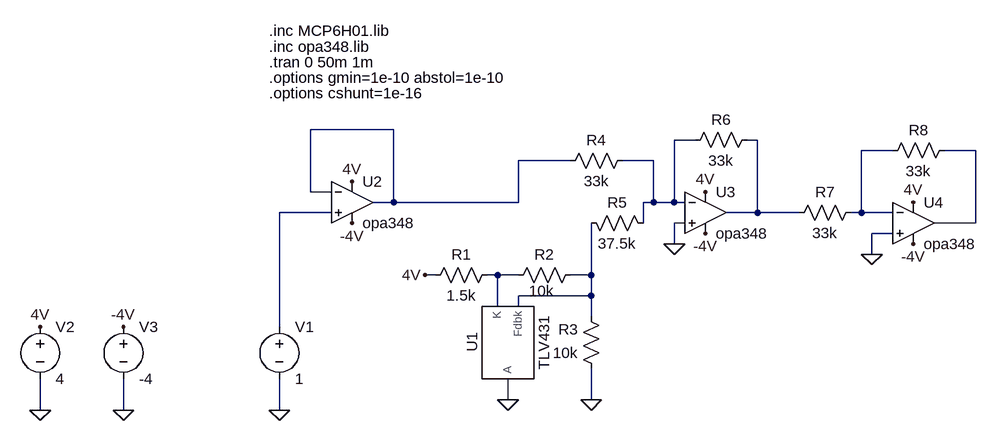
[diagram p0: schematic SUE_X.asc]
SUE_X.asc, the LTspice schematic file:
Version 4
SHEET 1 1056 680
WIRE 128 -160 0 -160
WIRE 592 -144 560 -144
WIRE 688 -144 672 -144
WIRE 896 -128 848 -128
WIRE 1024 -128 976 -128
WIRE 400 -112 320 -112
WIRE 528 -112 480 -112
WIRE 0 -64 0 -160
WIRE 32 -64 0 -64
WIRE 128 -48 128 -160
WIRE 128 -48 96 -48
WIRE 320 -48 320 -112
WIRE 320 -48 128 -48
WIRE 528 -48 528 -112
WIRE 528 -48 512 -48
WIRE 560 -48 560 -144
WIRE 560 -48 528 -48
WIRE 576 -48 560 -48
WIRE 32 -32 -48 -32
WIRE 688 -32 688 -144
WIRE 688 -32 640 -32
WIRE 752 -32 688 -32
WIRE 848 -32 848 -128
WIRE 848 -32 832 -32
WIRE 896 -32 848 -32
WIRE 512 -16 512 -48
WIRE 576 -16 560 -16
WIRE 1024 -16 1024 -128
WIRE 1024 -16 960 -16
WIRE 896 0 864 0
WIRE 560 16 560 -16
WIRE 864 32 864 0
WIRE 192 64 176 64
WIRE 288 64 272 64
WIRE 320 64 288 64
WIRE 432 64 432 -16
WIRE 432 64 400 64
WIRE 432 96 432 64
WIRE 432 96 320 96
WIRE 288 112 288 64
WIRE 320 112 320 96
WIRE 432 128 432 96
WIRE -48 144 -48 -32
WIRE 304 256 304 224
WIRE 432 256 432 208
WIRE -416 272 -416 224
WIRE -288 272 -288 224
WIRE -48 272 -48 224
FLAG -48 272 0
FLAG -416 272 0
FLAG -288 272 0
FLAG -416 144 4V
FLAG 64 -80 4V
FLAG 64 -16 -4V
FLAG -288 144 -4V
FLAG 176 64 4V
FLAG 304 256 0
FLAG 432 256 0
FLAG 608 -64 4V
FLAG 608 0 -4V
FLAG 560 16 0
FLAG 928 -48 4V
FLAG 928 16 -4V
FLAG 864 32 0
SYMBOL voltage -48 128 R0
WINDOW 123 0 0 Left 0
WINDOW 39 0 0 Left 0
SYMATTR InstName V1
SYMATTR Value 1
SYMBOL OpAmps\\opamp2 64 -112 R0
SYMATTR InstName U2
SYMATTR Value opa348
SYMBOL voltage -416 128 R0
WINDOW 123 0 0 Left 0
WINDOW 39 0 0 Left 0
SYMATTR InstName V2
SYMATTR Value 4
SYMBOL voltage -288 128 R0
WINDOW 123 0 0 Left 0
WINDOW 39 0 0 Left 0
SYMATTR InstName V3
SYMATTR Value -4
SYMBOL TLV431 304 176 R270
SYMATTR InstName U1
SYMBOL res 288 48 R90
WINDOW 0 0 56 VBottom 2
WINDOW 3 32 56 VTop 2
SYMATTR InstName R1
SYMATTR Value 1.5k
SYMBOL res 416 48 R90
WINDOW 0 0 56 VBottom 2
WINDOW 3 25 60 VTop 2
SYMATTR InstName R2
SYMATTR Value 10k
SYMBOL res 448 224 R180
WINDOW 0 36 76 Left 2
WINDOW 3 36 40 Left 2
SYMATTR InstName R3
SYMATTR Value 10k
SYMBOL res 496 -128 R90
WINDOW 0 0 56 VBottom 2
WINDOW 3 32 56 VTop 2
SYMATTR InstName R4
SYMATTR Value 33k
SYMBOL OpAmps\\opamp2 608 -96 R0
SYMATTR InstName U3
SYMATTR Value opa348
SYMBOL res 416 -32 M90
WINDOW 0 0 56 VBottom 2
WINDOW 3 32 56 VTop 2
SYMATTR InstName R5
SYMATTR Value 37.5k
SYMBOL res 688 -160 R90
WINDOW 0 0 56 VBottom 2
WINDOW 3 32 56 VTop 2
SYMATTR InstName R6
SYMATTR Value 33k
SYMBOL res 848 -48 R90
WINDOW 0 0 56 VBottom 2
WINDOW 3 32 56 VTop 2
SYMATTR InstName R7
SYMATTR Value 33k
SYMBOL res 992 -144 R90
WINDOW 0 0 56 VBottom 2
WINDOW 3 32 56 VTop 2
SYMATTR InstName R8
SYMATTR Value 33k
SYMBOL OpAmps\\opamp2 928 -80 R0
SYMATTR InstName U4
SYMATTR Value opa348
TEXT -64 -312 Left 2 !.inc MCP6H01.lib
TEXT -64 -264 Left 2 !.tran 0 50m 1m
TEXT -64 -240 Left 2 !.options gmin=1e-10 abstol=1e-10
TEXT -64 -216 Left 2 !.options cshunt=1e-16
TEXT -64 -288 Left 2 !.inc opa348.lib

The netlist it stands for:
* SUE_X.asc
V1 N006 0 1
XU2 N006 N001 4V -4V N001 opa348  ; pins In+ In- V+ V- OUT
V2 4V 0 4
V3 -4V 0 -4
XU1 0 N007 N008 TLV431  ; pins A K Fdbk
R1 N007 4V 1.5k
R2 N008 N007 10k
R3 0 N008 10k
R4 N002 N001 33k
XU3 0 N002 4V -4V N003 opa348  ; pins In+ In- V+ V- OUT
R5 N008 N002 37.5k
R6 N003 N002 33k
R7 N004 N003 33k
R8 N005 N004 33k
XU4 0 N004 4V -4V N005 opa348  ; pins In+ In- V+ V- OUT
.inc MCP6H01.lib
.tran 0 50m 1m
.options gmin=1e-10 abstol=1e-10
.options cshunt=1e-16
.inc opa348.lib
.lib C:\Users\Admin\Documents\Studia\LM331m1(1)\tlv431.lib
.backanno
.end